# EAGLE design Distance-Alarm (EAGLE 6.3)
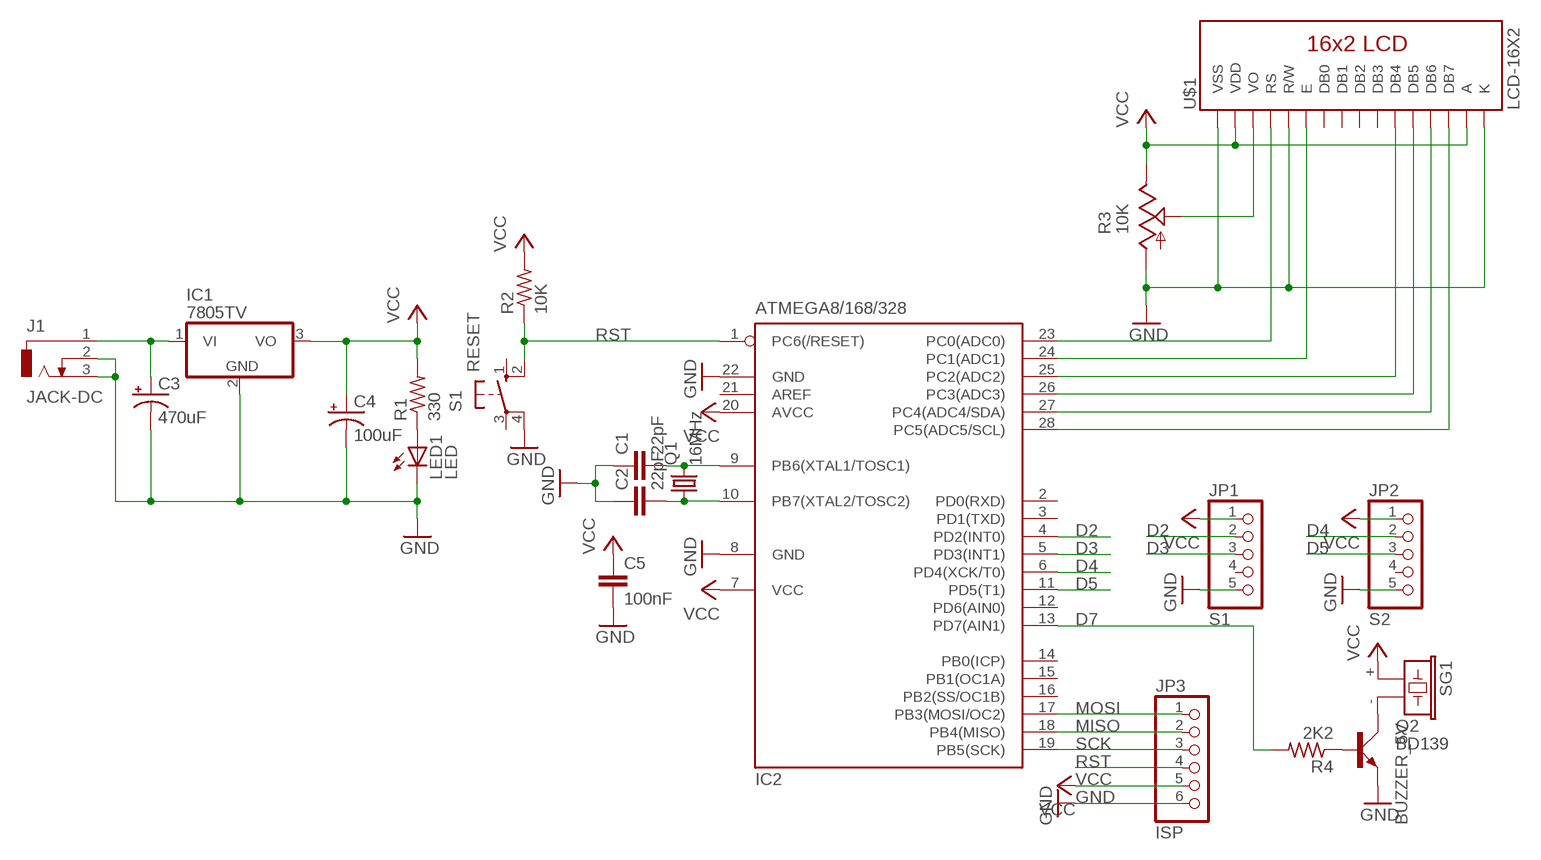
[diagram p0: schematic, sheet 1]

## Parts
C1  22pF  CAPACITOR-NONPOLAR025-024X044  [C025-024X044]
C2  22pF  CAPACITOR-NONPOLAR025-024X044  [C025-024X044]
C3  470uF  CAPACITOR-POLARE2.5-6  [E2,5-6]
C4  100uF  CAPACITOR-POLARE2.5-6  [E2,5-6]
C5  100nF  CAPACITOR-NONPOLAR025-024X044  [C025-024X044]
IC1  7805TV  [TO220V]
IC2  ATMEGA8/168/328  [DIL28-3]
J1  JACK-DC  [DCJ0202]
JP1  S1  PINHD-1X5  [1X05]
JP2  S2  PINHD-1X5  [1X05]
JP3  ISP  PINHD-1X6  [1X06]
LED1  LED  LED3MM  [LED3MM]
Q1  16MHz  CRYSTALHC49S  [HC49/S]
Q2  BD139  [TO126AV]
R1  330  RESISTOR0207/10  [0207/10]
R2  10K  RESISTOR0207/10  [0207/10]
R3  10K  TRIMPOTCA6V  [CA6V]
R4  2K2  RESISTOR0207/10  [0207/10]
S1  RESET  SW-PUSHBUTTON  [B3F-10XX]
SG1  BUZZER_5V  [BUZZER_F/CM12P]
U$1  LCD-16X2  [LCD-16X2]

## Nets
D2: IC2.4(PD2(INT0)) JP1.2
D3: IC2.5(PD3(INT1)) JP1.3
D4: IC2.6(PD4(XCK/T0)) JP2.2
D5: IC2.11(PD5(T1)) JP2.3
D7: IC2.13(PD7(AIN1)) R4.2
GND: C1.1 C2.1 C3.- C4.- C5.2 IC1.2(GND) IC2.8(GND) IC2.22(GND) J1.2 J1.3 JP1.5 JP2.5 JP3.6 LED1.K(C) Q2.E R3.A S1.4(P1) U$1.1(VSS) U$1.5(R/W) U$1.16(K)
MISO: IC2.18(PB4(MISO)) JP3.2
MOSI: IC2.17(PB3(MOSI/OC2)) JP3.1
N$1: C3.+ IC1.1(VI) J1.1
N$2: IC2.23(PC0(ADC0)) U$1.4(RS)
N$3: LED1.A R1.1
N$4: R3.S U$1.3(VO)
N$5: IC2.24(PC1(ADC1)) U$1.6(E)
N$6: C1.2 IC2.9(PB6(XTAL1/TOSC1)) Q1.2
N$7: C2.2 IC2.10(PB7(XTAL2/TOSC2)) Q1.1
N$8: IC2.25(PC2(ADC2)) U$1.11(DB4)
N$9: IC2.26(PC3(ADC3)) U$1.12(DB5)
N$10: IC2.27(PC4(ADC4/SDA)) U$1.13(DB6)
N$11: IC2.28(PC5(ADC5/SCL)) U$1.14(DB7)
N$12: Q2.C SG1.-
N$13: Q2.B R4.1
RST: IC2.1(PC6(/RESET)) JP3.4 R2.1 S1.2(S1)
SCK: IC2.19(PB5(SCK)) JP3.3
VCC: C4.+ C5.1 IC1.3(VO) IC2.7(VCC) IC2.20(AVCC) JP1.1 JP2.1 JP3.5 R1.2 R2.2 R3.E SG1.+ U$1.2(VDD) U$1.15(A)
Unconnected: IC2.2(PD0(RXD)) IC2.3(PD1(TXD)) IC2.12(PD6(AIN0)) IC2.14(PB0(ICP)) IC2.15(PB1(OC1A)) IC2.16(PB2(SS/OC1B)) IC2.21(AREF) JP1.4 JP2.4 S1.1(S) S1.3(P) U$1.7(DB0) U$1.8(DB1) U$1.9(DB2) U$1.10(DB3)

## Library data of the parts
C1 C2 C5 = barelang-store:CAPACITOR-NONPOLAR: CAPACITOR, European symbol
C3 C4 = barelang-store:CAPACITOR-POLAR: POLARIZED CAPACITOR, American symbol
IC1 = barelang-store:78*: Positive VOLTAGE REGULATOR Source: http://cache.national.com/ds/LM/LM78L05.pdf http://www.fairchildsemi.com/ds/LM/LM7805.pdf
IC2 = barelang-store:ATMEGA8/168/328: MICROCONTROLLER 8 Kbytes FLASH, 1 kbytes SRAM, 512 bytes EEPROM, USART, 4-channel 10 bit ADC, 2-channel 8 bit ADC Pin compatible with Atmega48, ATMega88, ATMega168 Source: avr.lbr; OC_FARNELL: unknown; OC_NEWARK: unknown
J1 = barelang-store:JACK-DC: DC POWER JACK Source: DCJ0202.pdf; OC_FARNELL: unknown; OC_NEWARK: unknown
JP1 JP2 = barelang-store:PINHD-1X5: PIN HEADER
JP3 = barelang-store:PINHD-1X6: PIN HEADER
LED1 = barelang-store:LED: LED OSRAM: - CHIPLED LG R971, LG N971, LY N971, LG Q971, LY Q971, LO R971, LY R971 LH N974, LH R974 LS Q976, LO Q976, LY Q976 LO Q996 - Hyper CHIPLED LW Q18S LB Q993, LB Q99A, LB R99A - SideLED LS A670, LO A670, LY A670, LG A670, LP A670 LB A673, LV A673, LT A673, LW A673 LH A674 LY A675 LS A676, LA A676, LO A676, LY A676, LW A676 LS A679, LY A679, LG A679 - Hyper Micro SIDELED® LS Y876, LA Y876, LO Y876, LY Y876 LT Y87S - SmartLED LW L88C, LW L88S LB L89C, LB L89S, LG L890 LS L89K, LO L89K, LY L89K LS L896, LA L896, LO L896, LY L896 - TOPLED LS T670, LO T670, LY T670, LG T670, LP T670 LSG T670, LSP T670, LSY T670, LOP T670, LYG T670 LG T671, LOG T671, LSG T671 LB T673, LV T673, LT T673, LW T673 LH T674 LS T676, LA T676, LO T676, LY T676, LB T676, LH T676, LSB T676, LW T676 LB T67C, LV T67C, LT T67C, LS T67K, LO T67K, LY T67K, LW E67C LS E67B, LA E67B, LO E67B, LY E67B, LB E67C, LV E67C, LT E67C LW T67C LS T679, LY T679, LG T679 LS T770, LO T770, LY T770, LG T770, LP T770 LB T773, LV T773, LT T773, LW T773 LH T774 LS E675, LA E675, LY E675, LS T675 LS T776, LA T776, LO T776, LY T776, LB T776 LHGB T686 LT T68C, LB T68C - Hyper Mini TOPLED® LB M676 - Mini TOPLED Santana® LG M470 LS M47K, LO M47K, LY M47K Source: http://www.osram.convergy.de LUXEON: - LUMILED® LXK2-PW12-R00, LXK2-PW12-S00, LXK2-PW14-U00, LXK2-PW14-V00 LXK2-PM12-R00, LXK2-PM12-S00, LXK2-PM14-U00 LXK2-PE12-Q00, LXK2-PE12-R00, LXK2-PE12-S00, LXK2-PE14-T00, LXK2-PE14-U00 LXK2-PB12-K00, LXK2-PB12-L00, LXK2-PB12-M00, LXK2-PB14-N00, LXK2-PB14-P00, LXK2-PB14-Q00 LXK2-PR12-L00, LXK2-PR12-M00, LXK2-PR14-Q00, LXK2-PR14-R00 LXK2-PD12-Q00, LXK2-PD12-R00, LXK2-PD12-S00 LXK2-PH12-R00, LXK2-PH12-S00 LXK2-PL12-P00, LXK2-PL12-Q00, LXK2-PL12-R00 Source: www.luxeon.com KINGBRIGHT: KA-3528ASYC Source: www.kingbright.com
Q1 = barelang-store:CRYSTAL: CRYSTAL; OC_FARNELL: 1667008; OC_NEWARK: unknown
Q2 = barelang-store:BD139: NPN TRANSISTOR
R1 R2 R4 = barelang-store:RESISTOR: RESISTOR, American symbol
R3 = barelang-store:TRIMPOT: POTENTIOMETER
S1 = barelang-store:SW-PUSHBUTTON: OMRON SWITCH; MPN: B3F-1000; OC_FARNELL: 176432; OC_NEWARK: 36M3542
SG1 = barelang-store:BUZZER_5V: BUZZER Source: Buerklin; OC_FARNELL: unknown; OC_NEWARK: unknown
U$1 = barelang-store:LCD-16X2

## Board
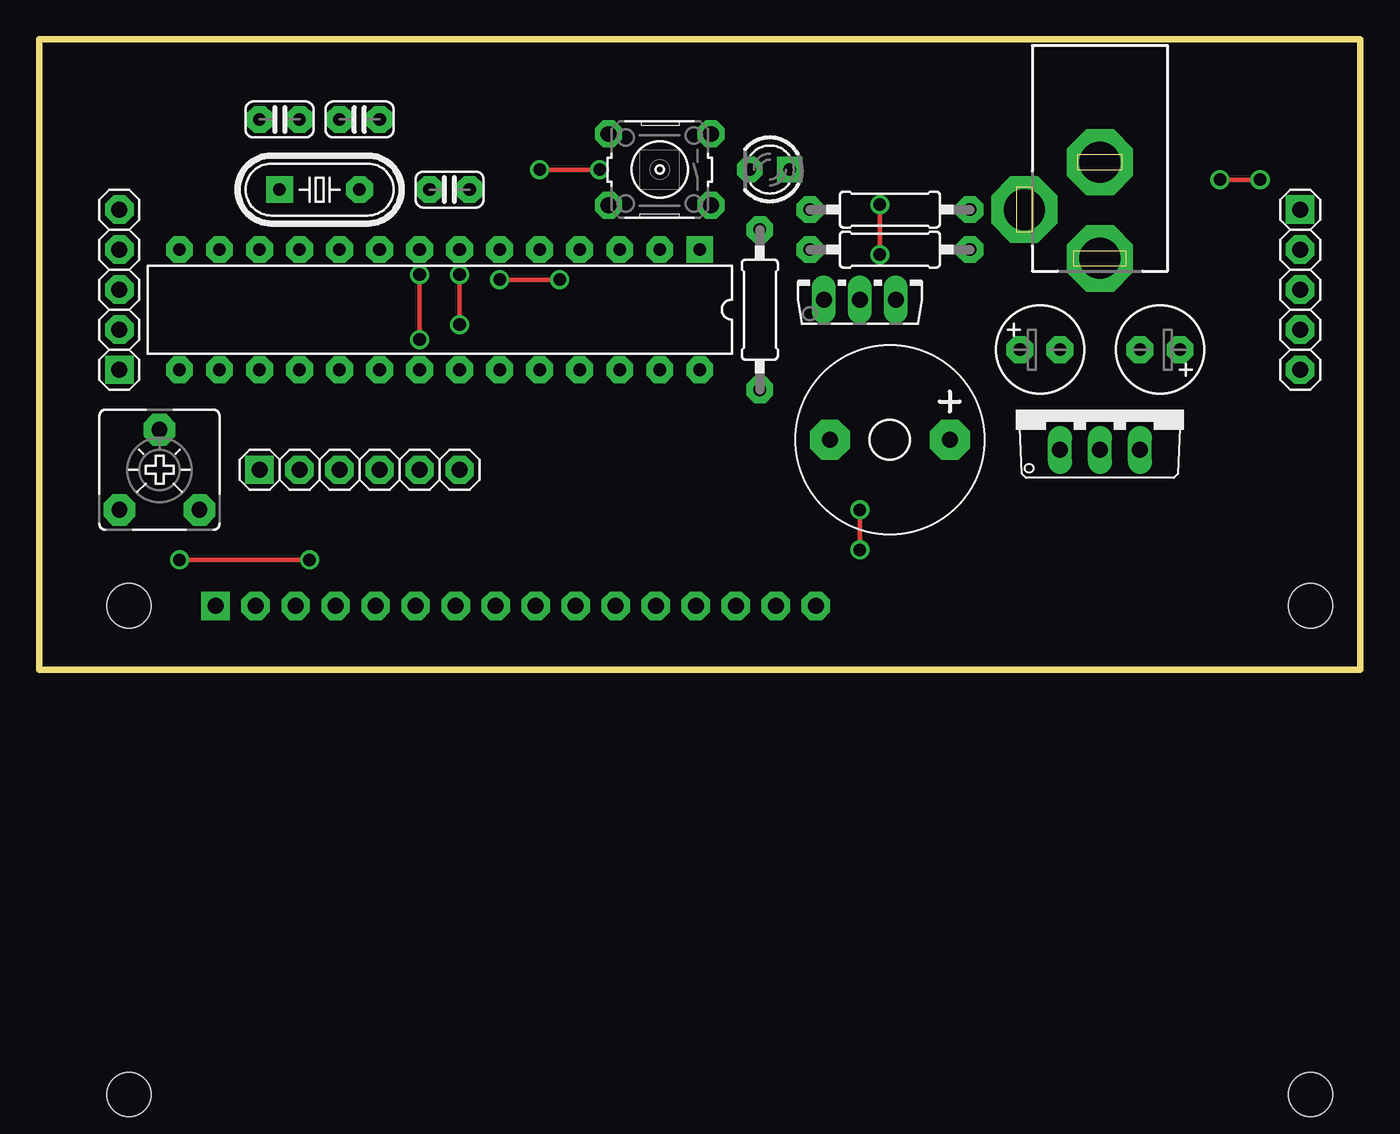
[diagram p1: board, top side]
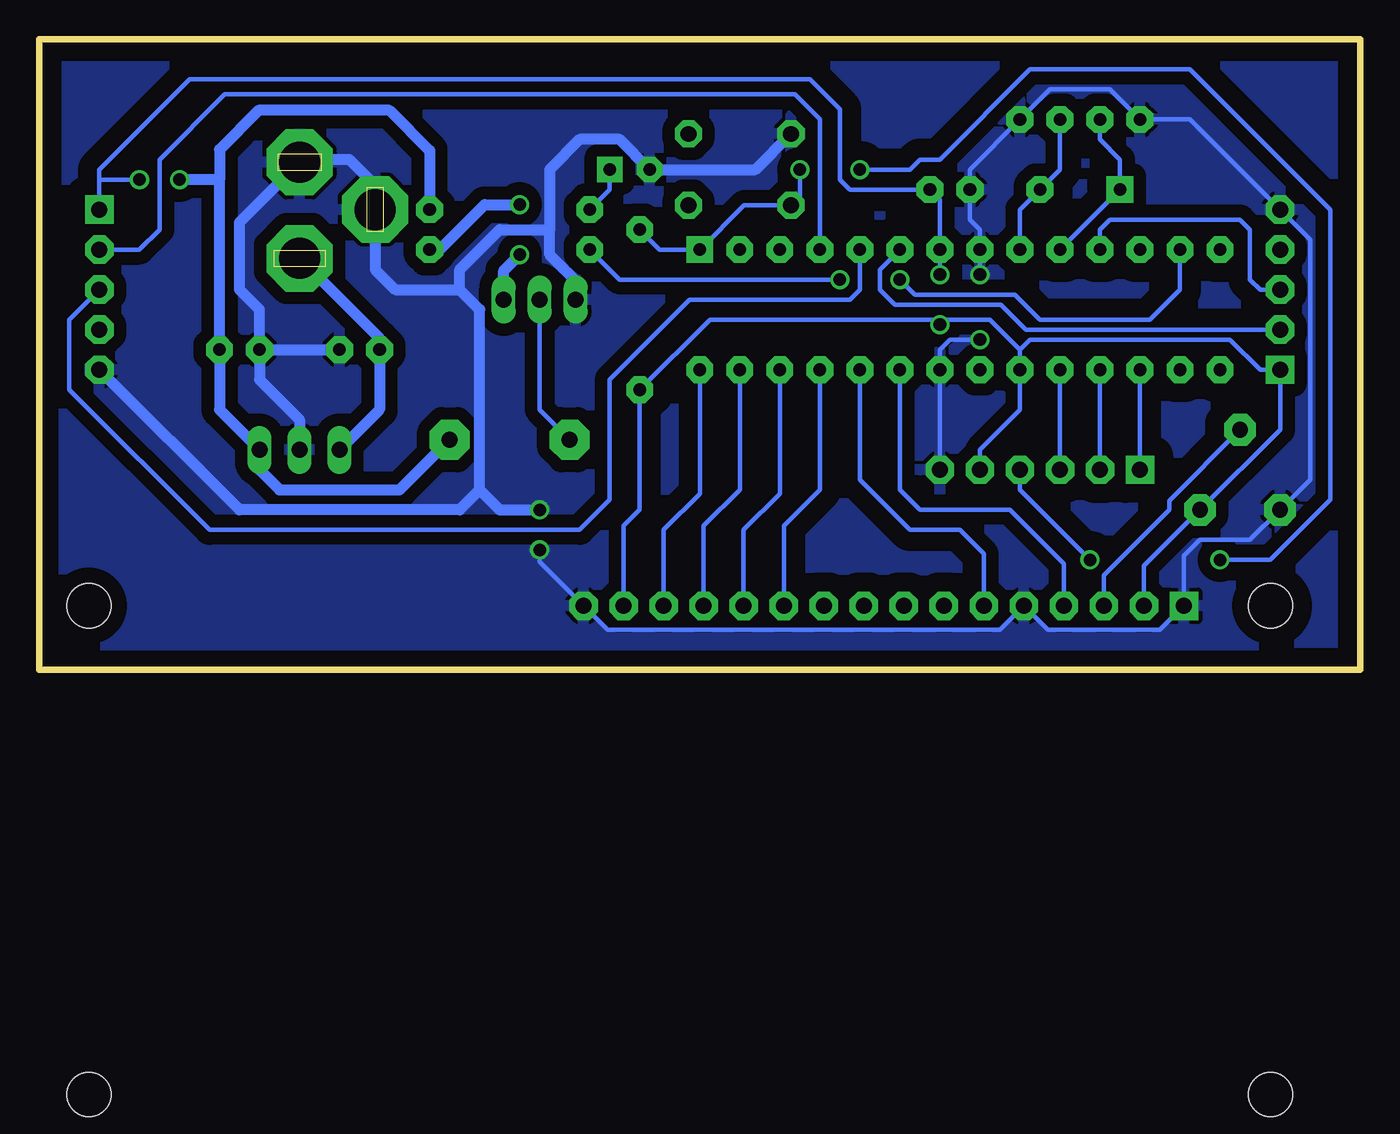
[diagram p2: board, bottom side, seen from below]

Size 83.82 x 40.01 mm. Coordinates in mm from the lower left corner, seen from the top.
Outline: 0,40.01 83.82,40.01 83.82,0 0,0 0,40.01
Copper layers (1*16): Top 0.035mm / dielectric 1.5mm / Bottom 0.035mm
Design rules "default *": minimum track width 0.3mm, minimum drill 0.8mm, track to track 10mil, track to pad 10mil, pad to pad 10mil, via to via 10mil, smd to smd 8mil, copper to edge 40mil, drill to drill 8mil, minimum pad ring 10mil, minimum via ring 8mil, stop-mask expansion 4mil, vias tented up to drill 0mil, thermal gap 10mil

### Footprints (pad centres in the part's own frame; a part is rotated, then mirrored left to right if it is on the bottom)
C025-024X044 = drill 0.8 pad 1.7 octagon: 1 -1.27,0; 2 1.27,0
E2,5-6 = drill 0.8 pad 1.7 octagon: + -1.27,0; - 1.27,0
TO220V = drill 1.016 long: 1 -2.54,-2.54; 2 0,-2.54; 3 2.54,-2.54
DIL28-3 = drill 0.8 pad 1.7 square: 1 -16.51,-3.81 | drill 0.8 pad 1.7 octagon: 2 -13.97,-3.81; 3 -11.43,-3.81; 4 -8.89,-3.81; 5 -6.35,-3.81; 6 -3.81,-3.81; 7 -1.27,-3.81; 8 1.27,-3.81; 9 3.81,-3.81; 10 6.35,-3.81; 11 8.89,-3.81; 12 11.43,-3.81; 13 13.97,-3.81; 14 16.51,-3.81; 15 16.51,3.81; 16 13.97,3.81; 17 11.43,3.81; 18 8.89,3.81; 19 6.35,3.81; 20 3.81,3.81; 21 1.27,3.81; 22 -1.27,3.81; 23 -3.81,3.81; 24 -6.35,3.81; 25 -8.89,3.81; 26 -11.43,3.81; 27 -13.97,3.81; 28 -16.51,3.81
DCJ0202 = drill 2.6 pad 4.2 octagon: 1 0,3.1; 2 4.8,0; 3 0,-3
1X05 = drill 1.016 pad 1.8 square: 1 -5.08,0 | drill 1.016 pad 1.8 octagon: 2 -2.54,0; 3 0,0; 4 2.54,0; 5 5.08,0
1X06 = drill 1.016 pad 1.8 square: 1 -6.35,0 | drill 1.016 pad 1.8 octagon: 2 -3.81,0; 3 -1.27,0; 4 1.27,0; 5 3.81,0; 6 6.35,0
LED3MM = drill 0.8 pad 1.6 square: A -1.27,0 | drill 0.8 pad 1.6 octagon: K 1.27,0
HC49/S = drill 0.8 pad 1.7 square: 1 -2.54,0 | drill 0.8 pad 1.7 octagon: 2 2.54,0
TO126AV = drill 1.016 long: B 2.286,-1.27; C 0,-1.27; E -2.286,-1.27
0207/10 = drill 0.8 pad 1.7 octagon: 1 -5.08,0; 2 5.08,0
CA6V = drill 1 pad 2 octagon: A -2.54,-2.54; E 2.54,-2.54; S 0,2.54
B3F-10XX = drill 1 pad 1.7 octagon: 1 -3.251,2.261; 2 3.251,2.261; 3 -3.251,-2.261; 4 3.251,-2.261
BUZZER_F/CM12P = drill 1.016 pad 2.54 octagon: + 3.81,0; - -3.81,0
LCD-16X2 = drill 1.016 pad 1.8 square: 1 -32,15.5 | drill 1.016 pad 1.8 octagon: 2 -29.46,15.5; 3 -26.92,15.5; 4 -24.38,15.5; 5 -21.84,15.5; 6 -19.3,15.5; 7 -16.76,15.5; 8 -14.22,15.5; 9 -11.68,15.5; 10 -9.14,15.5; 11 -6.6,15.5; 12 -4.06,15.5; 13 -1.52,15.5; 14 1.02,15.5; 15 3.56,15.5; 16 6.1,15.5 | hole 2.8: -37.5,15.5; -37.5,-15.5; 37.5,15.5; 37.5,-15.5

### Placement (x,y rotation side)
C1  20.32,34.92 180 top
C2  15.24,34.92 0 top
C3  63.5,20.32 0 top
C4  71.12,20.32 180 top
C5  26.04,30.48 180 top
IC1  67.31,16.51 0 top
IC2  25.4,22.86 180 top
J1  67.31,29.21 180 top
JP1  80.01,24.13 270 top
JP2  5.08,24.13 90 top
JP3  20.32,12.7 0 top
LED1  46.36,31.75 180 top
Q1  17.78,30.48 0 top
Q2  52.07,24.76 0 top
R1  53.98,29.21 0 top
R2  45.72,22.86 270 top
R3  7.62,12.7 0 top
R4  53.98,26.67 180 top
S1  39.37,31.75 180 top
SG1  53.98,14.6 0 top
U$1  43.18,-11.43 0 top

### Tracks (layer width: path | path; a pad name or v marks a point on that pad's centre or on a via)
D2
  Bottom 0.3: JP1.2 77.47,26.67 76.2,27.94 76.2,32.38 72.07,36.51 35.88,36.51 34.29,34.92 IC2.4
D3
  Bottom 0.3: JP1.3 81.91,22.22 81.91,17.78 73.03,8.89 49.53,8.89 47.62,10.79 47.62,18.41 42.55,23.49 32.38,23.49 31.75,24.13 IC2.5
D4
  Bottom 0.3: IC2.6 30.48,25.4 30.48,24.13 29.53,23.18 22.8,23.18 21.21,21.59 JP2.2
D5
  Bottom 0.3: JP2.3 6.35,24.13 6.98,24.76 6.98,27.94 7.62,28.57 15.88,28.57 16.51,27.94 IC2.11
D7  (via drill 0.8)
  Top 0.3: v29.21,24.76 v33.02,24.76
  Bottom 0.3: IC2.13 11.43,24.13 13.34,22.22 20.32,22.22 21.91,23.81 28.26,23.81 v29.21,24.76 | v33.02,24.76 46.99,24.76 R4.2
GND  (via drill 0.8)
  Top 0.3: v24.13,20.95 v24.13,25.08 | v52.07,7.62 v52.07,10.16
  Bottom 0.3: JP3.6 IC2.22 26.67,20.32 26.04,20.95 v24.13,20.95 | U$1.1 12.7,2.54 19.81,2.54 U$1.5 22.87,2.54 47.75,2.54 U$1.16 52.07,6.86 v52.07,7.62 | U$1.1 | v24.13,25.08 IC2.8 24.13,27.94 24.77,28.57 C5.2 24.77,31.75 C1.1 19.68,36.83 15.88,36.83 C2.1 10.79,34.92 JP2.5 3.18,27.3 3.18,12.06 R3.A 6.98,8.25 10.16,8.25 11.18,7.23 U$1.1 | 67.13,32.38 J1.3
  Bottom 0.7: 57.15,24.13 57.15,25.4 54.61,27.94 51.44,27.94 | 57.15,24.13 61.24,24.13 62.51,25.4 J1.2 62.51,30.76 64.13,32.38 67.13,32.38 | 55.88,11.43 54.61,10.16 v52.07,10.16 | 55.88,11.43 55.88,22.86 57.15,24.13 | C4.- 69.85,22.86 71.12,24.13 71.12,28.4 J1.3 | S1.4 38.38,31.75 LED1.K 46.99,33.65 49.53,33.65 51.44,31.75 51.44,27.94 | 55.88,11.43 57.15,10.16 71.12,10.16 JP1.5 | C4.- C3.- | C4.- 69.85,18.41 67.31,15.88 IC1.2 | Q2.E 49.78,24.7 51.44,26.35 51.44,27.94
  pour Bottom (isolate 0.8): 0,0 83.82,0 83.82,40.01 0,40.01
MISO
  Bottom 0.3: IC2.18 JP3.2
MOSI
  Bottom 0.3: JP3.1 IC2.17
N$1
  Bottom 0.3: 62.23,21.03 C3.+
  Bottom 0.7: C3.+ 62.23,16.51 IC1.1 | J1.1 62.23,21.03
N$2
  Bottom 0.3: IC2.23 29.21,11.43 27.94,10.16 22.23,10.16 18.8,6.73 U$1.4
N$3
  Bottom 0.3: LED1.A 47.62,30.48 R1.1
N$4
  Bottom 0.3: U$1.3 16.26,6.01 12.12,10.16 12.12,10.74 R3.S
N$5
  Bottom 0.3: IC2.24 31.75,12.06 28.58,8.89 25.4,8.89 23.88,7.37 U$1.6
N$6
  Bottom 0.3: IC2.9 21.59,29.21 Q1.2 19.05,31.75 C1.2
N$7
  Bottom 0.3: IC2.10 Q1.1 15.24,32.38 16.51,33.65 C2.2
N$8
  Bottom 0.3: IC2.25 34.29,11.43 36.58,9.14 U$1.11
N$9
  Bottom 0.3: U$1.12 39.12,8.89 36.83,11.18 IC2.26
N$10
  Bottom 0.3: IC2.27 39.37,11.43 41.66,9.14 U$1.13
N$11
  Bottom 0.3: U$1.14 44.2,8.89 41.91,11.18 IC2.28
N$12
  Bottom 0.3: Q2.C 52.07,16.51 SG1.-
N$13  (via drill 0.8)
  Top 0.3: v53.34,26.35 v53.34,29.53
  Bottom 0.7: v53.34,29.53 55.56,29.53 58.42,26.67 R4.1 | Q2.B 54.36,25.34 v53.34,26.35
N$14
  pour Bottom (isolate 1.2): 0,0 83.82,0 83.82,40.01 0,40.01
RST  (via drill 0.8)
  Top 0.3: v35.56,31.75 v31.75,31.75 | v8.89,6.98 v17.14,6.98
  Bottom 0.3: R2.1 44.45,26.67 IC2.1 39.09,29.49 S1.2 35.56,30.05 v35.56,31.75 | v17.14,6.98 21.59,11.43 JP3.4 | v8.89,6.98 5.71,6.98 1.91,10.79 1.91,29.21 10.79,38.1 20.96,38.1 26.67,32.38 27.94,32.38 28.58,31.75 v31.75,31.75
SCK
  Bottom 0.3: IC2.19 JP3.3
VCC  (via drill 0.8)
  Top 0.3: v26.67,25.08 v26.67,21.91 | v74.93,31.12 v77.47,31.12
  Bottom 0.3: 80.01,31.12 80.01,31.75 74.3,37.46 34.92,37.46 33.02,35.56 33.02,31.12 32.38,30.48 C5.1 26.67,29.84 IC2.7 v26.67,25.08 | 80.01,31.12 JP1.1 | U$1.15 46.74,9.14 45.72,10.16 R2.2 41.27,22.22 26.99,22.22 v26.67,21.91 26.35,22.22 23.5,22.22 21.59,20.32 | U$1.2 13.72,6.6 R3.E 5.08,15.24 JP2.1 6.35,19.05 8.26,20.95 20.96,20.95 21.59,20.32 | JP3.5 24.13,13.97 21.59,16.51 IC2.20 21.59,20.32 | v77.47,31.12 80.01,31.12
  Bottom 0.7: R1.2 59.05,32.95 61.59,35.49 69.91,35.49 72.39,33.02 72.39,31.12 | SG1.+ 60.96,11.43 68.58,11.43 69.85,12.7 IC1.3 72.39,16.51 C4.+ 72.39,31.12 | 72.39,31.12 v74.93,31.12